# EAGLE schematic buzzer_sub_module (EAGLE 7.6.0)
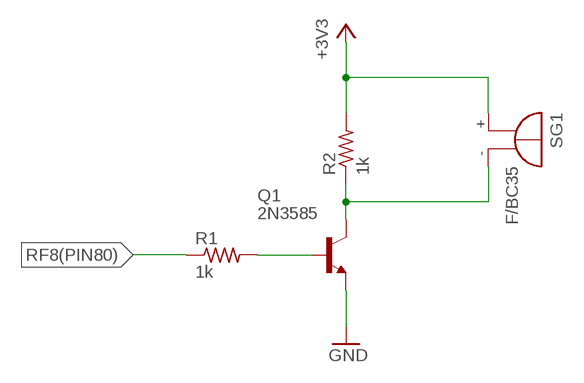
[diagram p0: schematic, sheet 1]

## Parts
Q1  2N3585  [TO66]
R1  1k  R-US_0204/2V  [0204V]
R2  1k  R-US_0204/2V  [0204V]
SG1  F/BC35  [F/BC35]

## Nets
+3V3: R2.2 SG1.+
GND: Q1.1(E)
N$2: Q1.2(B) R1.2
N$3: Q1.3(C) Q1.TO66(C) R2.1 SG1.-
RF8(PIN80): R1.1

## Library data of the parts
Q1 = transistor-npn:2N3585: NPN Transistor
R1 R2 = resistor:R-US_: RESISTOR, American symbol
SG1 = buzzer:F/BC35: BUZZER Source: Spoerle; OC_FARNELL: unknown; OC_NEWARK: unknown